# Altium schematic sheet SH01-TITLE.SchDoc
size A4
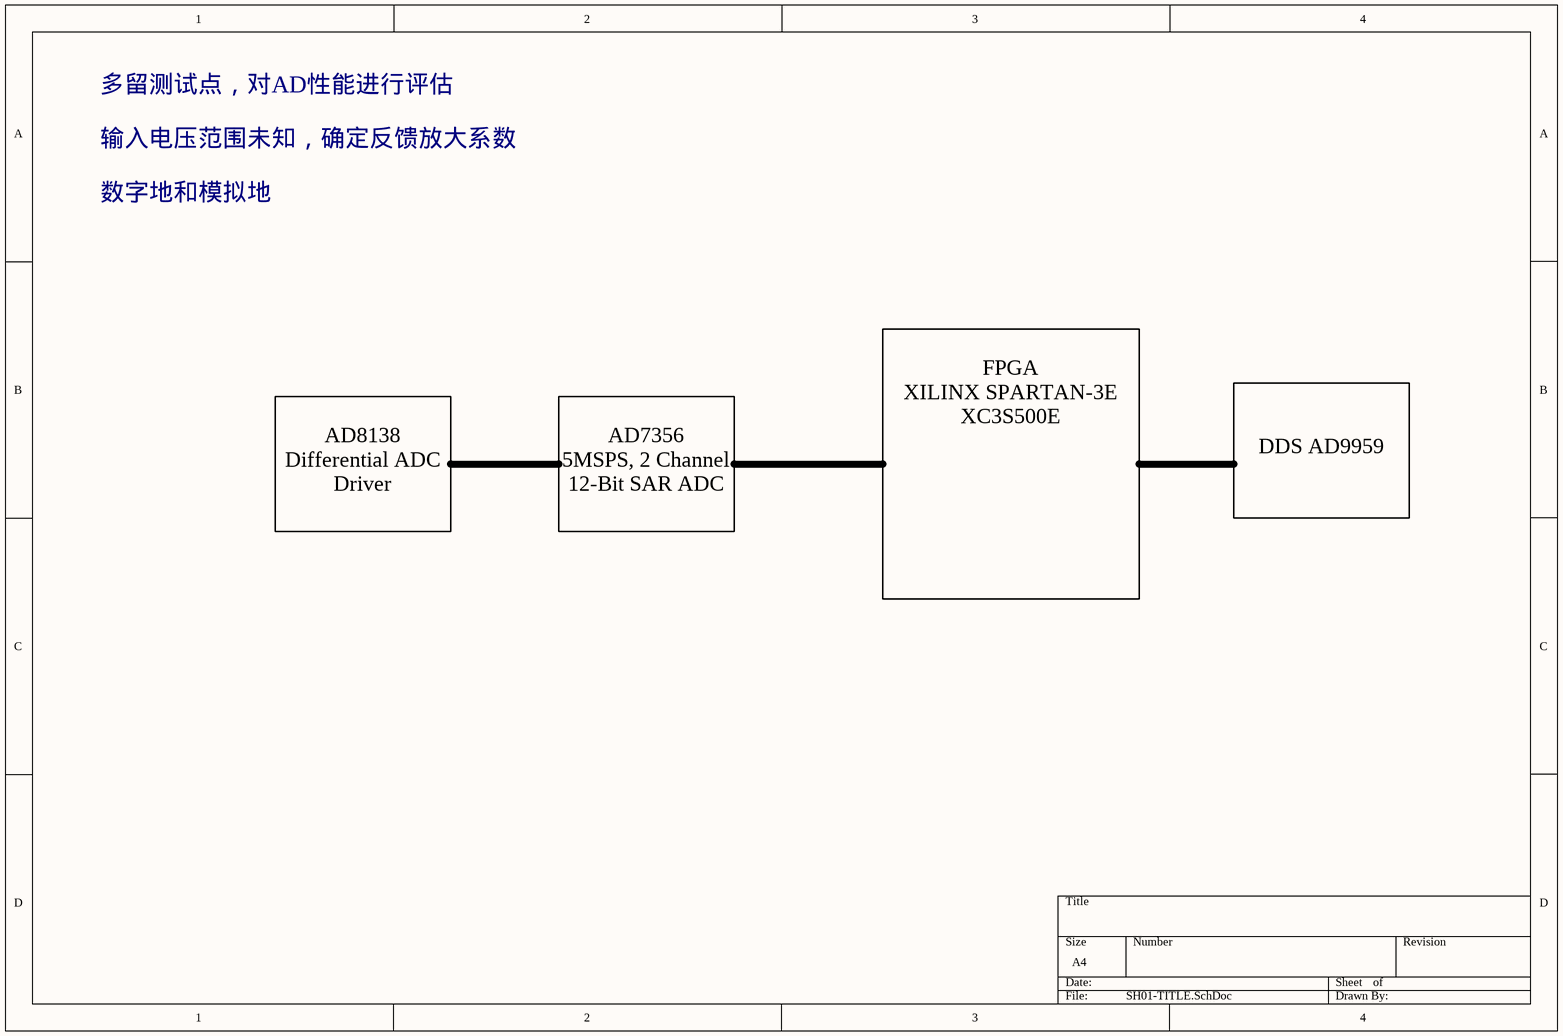
[diagram p0: SH01-TITLE.SchDoc]

## Notes on the sheet
- 多留测试点，对AD性能进行评估
- 输入电压范围未知，确定反馈放大系数
- 数字地和模拟地
- DDS AD9959
- AD8138
  Differential ADC
  Driver
- AD7356
  5MSPS, 2 Channel
  12-Bit SAR ADC
- FPGA
  XILINX SPARTAN-3E
  XC3S500E